# EAGLE schematic geiger (EAGLE 6.4)
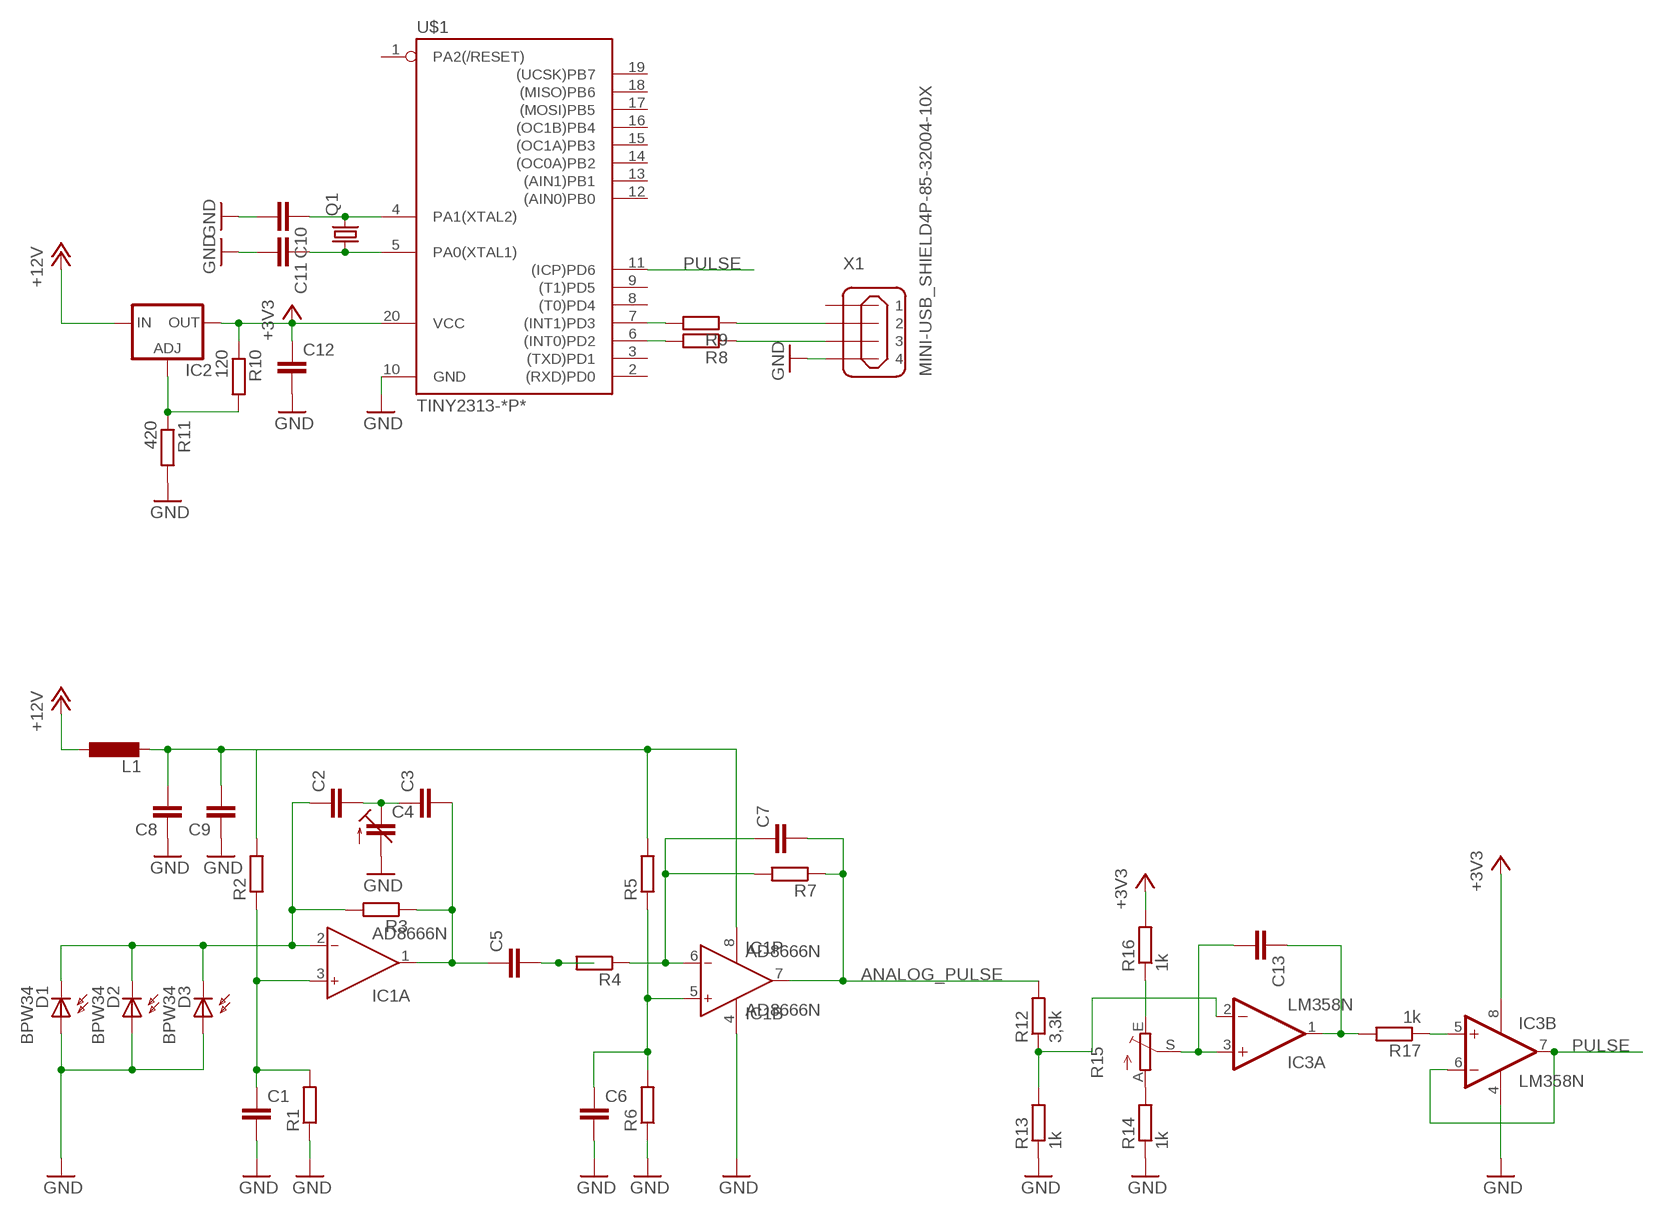
[diagram p0: schematic, sheet 1]

## Parts
C1  C-EU025-025X050  [C025-025X050]
C2  C-EU025-025X050  [C025-025X050]
C3  C-EU025-025X050  [C025-025X050]
C4  C-TRIMM3050.504  [CTRIM3050.504]
C5  C-EU025-025X050  [C025-025X050]
C6  C-EU025-025X050  [C025-025X050]
C7  C-EU025-025X050  [C025-025X050]
C8  C-EU025-025X050  [C025-025X050]
C9  C-EU025-025X050  [C025-025X050]
C10  C-EU025-025X050  [C025-025X050]
C11  C-EU025-025X050  [C025-025X050]
C12  C-EU025-025X050  [C025-025X050]
C13  C-EU025-025X050  [C025-025X050]
D1  BPW34  BPW32  [BPW32]
D2  BPW34  BPW32  [BPW32]
D3  BPW34  BPW32  [BPW32]
IC1  AD8666N  AD8066N  [DIL08]
IC2  LM317L  [317L]
IC3  LM358N  [DIL08]
L1  L-EU2200-12.7  [2200-12.7]
Q1  CRYSTALHC49S  [HC49/S]
R1  R-EU_0207/7  [0207/7]
R2  R-EU_0207/7  [0207/7]
R3  R-EU_0207/7  [0207/7]
R4  R-EU_0207/7  [0207/7]
R5  R-EU_0207/7  [0207/7]
R6  R-EU_0207/7  [0207/7]
R7  R-EU_0207/7  [0207/7]
R8  R-EU_0207/7  [0207/7]
R9  R-EU_0207/7  [0207/7]
R10  120  R-EU_0207/7  [0207/7]
R11  420  R-EU_0207/7  [0207/7]
R12  3,3k  R-EU_0207/7  [0207/7]
R13  1k  R-EU_0207/7  [0207/7]
R14  1k  R-EU_0207/7  [0207/7]
R15  TRIM_EU-LI10  [LI10]
R16  1k  R-EU_0207/7  [0207/7]
R17  1k  R-EU_0207/7  [0207/7]
U$1  TINY2313-*P*  [DIL20]
X1  MINI-USB_SHIELD4P-85-32004-10X  [85-32004-10X]

## Nets
+3V3: C12.1 IC2.2(OUT) IC3.8(P:V+) R10.1 R16.2 U$1.20(VCC)
+12V: IC2.3(IN) L1.1
ANALOG_PULSE: C7.2 IC1.7(B:OUT) R7.1 R12.2
GND: C1.2 C4.2(A) C6.2 C8.1 C9.1 C10.2 C11.2 C12.2 D1.A D2.A D3.A IC1.4(P:V-) IC3.4(P:V-) R1.1 R6.1 R11.2 R13.1 R14.1 U$1.10(GND) X1.4
N$1: C3.2 C5.1 IC1.1(A:OUT) R3.1
N$2: C2.1 D1.K(C) D2.K(C) D3.K(C) IC1.2(A:IN-) R3.2
N$3: C2.2 C3.1 C4.1(E)
N$4: C1.1 IC1.3(A:IN+) R1.2 R2.1
N$5: C10.1 Q1.2 U$1.4(PA1(XTAL2))
N$6: C5.2 R4.2
N$7: C7.1 IC1.6(B:IN-) R4.1 R7.2
N$8: C6.1 IC1.5(B:IN+) R5.1 R6.2
N$9: C11.1 Q1.1 U$1.5(PA0(XTAL1))
N$10: R8.2 U$1.6((INT0)PD2)
N$11: R9.2 U$1.7((INT1)PD3)
N$12: C8.2 C9.2 IC1.8(P:V+) L1.2 R2.2 R5.2
N$13: R9.1 X1.2
N$14: R8.1 X1.3
N$15: IC2.1(ADJ) R10.2 R11.1
N$16: R14.2 R15.A
N$17: IC3.2(A:-IN) R12.1 R13.2
N$18: R15.E R16.1
N$19: C13.2 IC3.3(A:+IN) R15.S
N$21: C13.1 IC3.1(A:OUT) R17.2
N$22: IC3.5(B:+IN) R17.1
PULSE: IC3.6(B:-IN) IC3.7(B:OUT) U$1.11((ICP)PD6)
Unconnected: U$1.1(PA2(/RESET)) U$1.2((RXD)PD0) U$1.3((TXD)PD1) U$1.8((T0)PD4) U$1.9((T1)PD5) U$1.12((AIN0)PB0) U$1.13((AIN1)PB1) U$1.14((OC0A)PB2) U$1.15((OC1A)PB3) U$1.16((OC1B)PB4) U$1.17((MOSI)PB5) U$1.18((MISO)PB6) U$1.19((UCSK)PB7) X1.1 X1.M1(S1) X1.M2(S2)

## Library data of the parts
C1-C3 C5-C13 = resistor:C-EU: CAPACITOR, European symbol
C4 = resistor:C-TRIMM: Trimm capacitor
D1-D3 = opto-trans-siemens:BPW32: PHOTO DIODE; OC_FARNELL: unknown; OC_NEWARK: unknown
IC1 = analog-devices:AD8066: High Performance, 145 MHz FastFET Op Amps Source: http://www.analog.com/static/imported-files/data_sheets/AD8065_8066.pdf; OC_FARNELL: unknown; OC_NEWARK: unknown
IC2 = v-reg:LM317L: VOLTAGE REGULATOR
IC3 = linear:LM358: OP AMP also LM158; LM258; LM2904 Source: http://cache.national.com/ds/LM/LM158.pdf
L1 = resistor:L-EU: INDUCTOR, European symbol
Q1 = crystal:CRYSTAL: CRYSTAL; OC_FARNELL: 1667008; OC_NEWARK: unknown
R1-R14 R16 R17 = resistor:R-EU_: RESISTOR, European symbol
R15 = pot:TRIM_EU-: POTENTIOMETER
U$1 = avr-6:TINY2313*: Atmel Tiny2313 2K Flash, 128 bytes EEPROM, 128 bytes RAM
X1 = con-cypressindustries:MINI-USB_SHIELD4P-: MINI USB 4 Pol. Source: www.cypressindustries.com; OC_FARNELL: unknown; OC_NEWARK: unknown